# Altium schematic sheet ATtiny.SchDoc
size A4
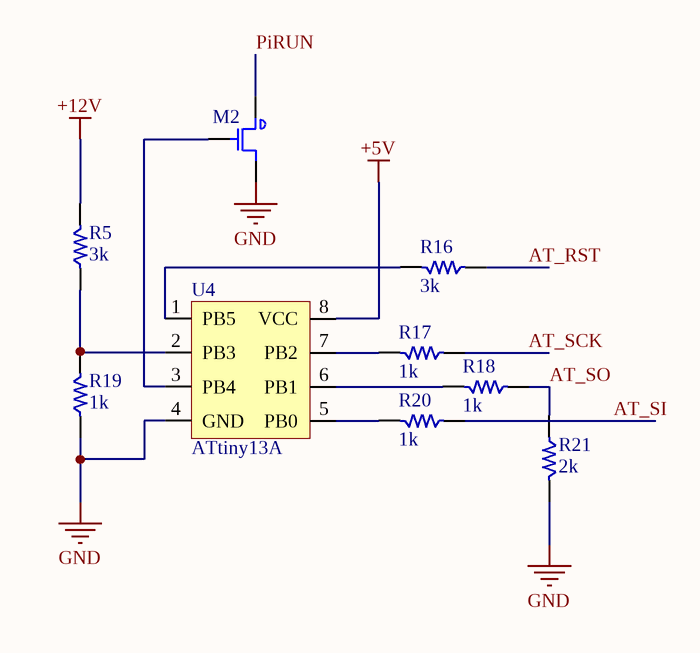
[diagram p0: ATtiny.SchDoc]

## Parts
M2  N-CH Mosfet Switch  [SOT32-3]  (value not drawn)
R5  value 3k  [0805]  (hidden comment: Resistor)
R16  value 3k  [0805]  (hidden comment: Resistor)
R17  value 1k  [0805]  (hidden comment: Resistor)
R18  value 1k  [0805]  (hidden comment: Resistor)
R19  value 1k  [0805]  (hidden comment: Resistor)
R20  value 1k  [0805]  (hidden comment: Resistor)
R21  value 2k  [0805]  (hidden comment: Resistor)
U4  ATtiny13A  [ATtiny13A]

## Nets
+5V: U4.8(VCC)
+12V: R5.2
GND: M2.2(S) R19.1 R21.2 U4.4(GND)
AT_RST: R16.1
AT_SCK: R17.1
AT_SI: R20.1
AT_SO: R18.1 R21.1
PiRUN: M2.3(D)
NetM2_1: M2.1(G) U4.3(PB4)
NetR5_1: R5.1 R19.2 U4.2(PB3)
NetR16_2: R16.2 U4.1(PB5)
NetR17_2: R17.2 U4.7(PB2)
NetR18_2: R18.2 U4.6(PB1)
NetR20_2: R20.2 U4.5(PB0)

## Library data of the parts
M2 = BSH105,215: MOSFET N-CH 20V 1.05A SOT23; Manufacturer: NXP USA Inc.; FET Type: N-Channel; Current - Continuous Drain (Id) @ 25°C: 1.05A (Ta); Drive Voltage (Max Rds On,  Min Rds On): 1.8V, 4.5V; Vgs(th) (Max) @ Id: 570mV @ 1mA; Gate Charge (Qg) (Max) @ Vgs: 3.9nC @ 4.5V; Input Capacitance (Ciss) (Max) @ Vds: 152pF @ 16V; Vgs (Max): ±8V; Power Dissipation (Max): 417mW (Ta); Rds On (Max) @ Id, Vgs: 200 mOhm @ 600mA, 4.5V; Supplier 1: Digi-Key; Manufacturer Part Number: BSH105,215; Pricing 1: 1=0.53, 10=0.425, 100=0.2902, 500=0.21758, 1000=0.16318 (CAD); Packaging: Cut Tape (CT); Part Status: Active; Technology: MOSFET (Metal Oxide); Drain to Source Voltage (Vdss): 20V; FET Feature: -; Operating Temperature: -55°C ~ 150°C (TJ); Mounting Type: Surface Mount; Supplier Device Package: TO-236AB (SOT23); Package / Case: TO-236-3, SC-59, SOT-23-3; ComponentLink1URL: http://www.nxp.com/documents/data_sheet/BSH105.pdf; ComponentLink1Description: http://www.nxp.com/documents/data_sheet/BSH105.pdf; Supplier Part Number 1: 568-6215-1-ND
R5 R16-R21 = Resistor: Generic Resistor
U4 = ATtiny13A: Manufacturer: Microchip Technology; Manufacturer Part Number: ATTINY13A-SSU; Core Processor: AVR; Core Size: 8-Bit; Speed: 20MHz; Peripherals: Brown-out Detect/Reset, POR, PWM, WDT; Number of I/O: 6; Program Memory Size: 1KB (512 x 16); Program Memory Type: FLASH; EEPROM Size: 64 x 8; Voltage - Supply (Vcc/Vdd): 1.8 V ~ 5.5 V; Data Converters: A/D 4x10b; Oscillator Type: Internal; Supplier 1: Digi-Key; Pricing 1: 1=0.89, 25=0.8096, 100=0.7319 (CAD); Packaging: Tube; Part Status: Active; Connectivity: -; RAM Size: 64 x 8; Operating Temperature: -40°C ~ 85°C (TA); Package / Case: 8-SOIC (0.154", 3.90mm Width); Supplier Device Package: 8-SOIC; ComponentLink1URL: http://ww1.microchip.com/downloads/en/devicedoc/8126s.pdf; ComponentLink1Description: http://ww1.microchip.com/downloads/en/devicedoc/8126s.pdf; Supplier Part Number 1: ATTINY13A-SSU-ND